# EAGLE design domino-clock-r1-displayonly (EAGLE 5.11)
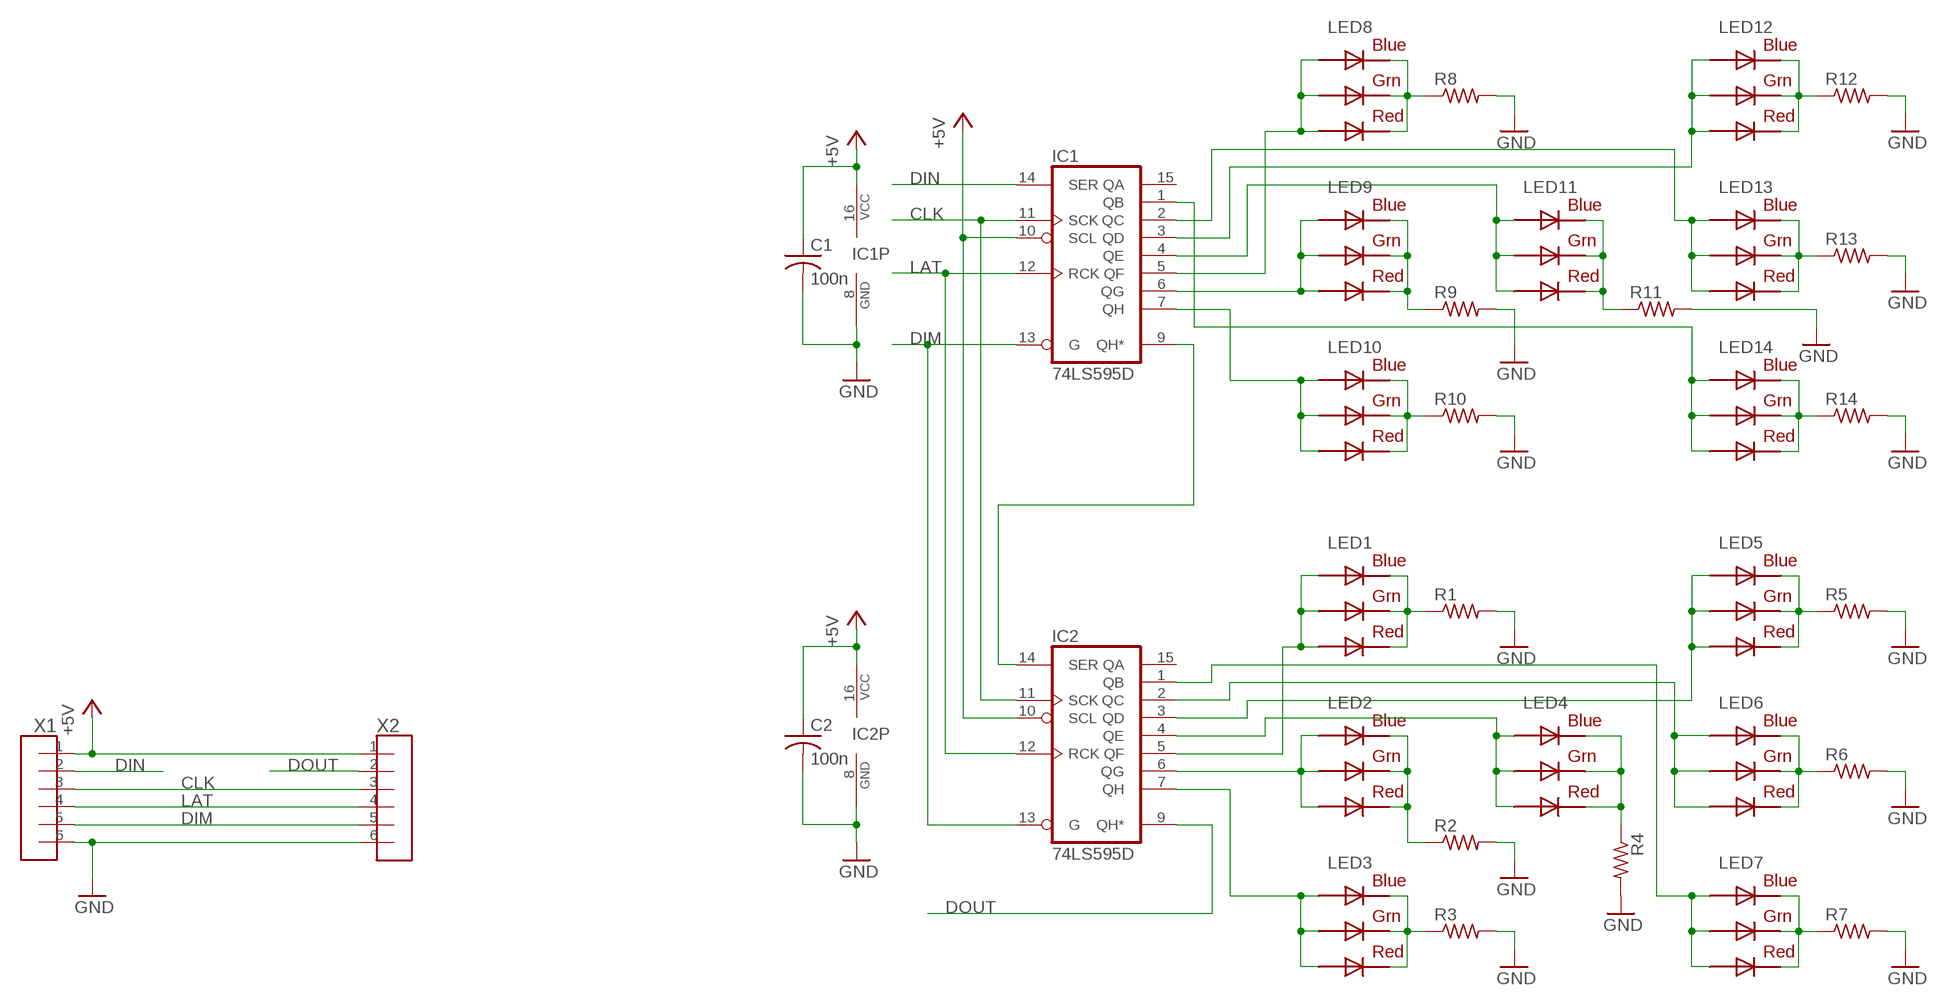
[diagram p0: schematic, sheet 1]

## Parts
C1  100n  C-USC0603  [C0603]
C2  100n  C-USC0603  [C0603]
IC1  74LS595D  [SO16]
IC2  74LS595D  [SO16]
LED1  RGBLED5050  [RGBLED5050]
LED2  RGBLED5050  [RGBLED5050]
LED3  RGBLED5050  [RGBLED5050]
LED4  RGBLED5050  [RGBLED5050]
LED5  RGBLED5050  [RGBLED5050]
LED6  RGBLED5050  [RGBLED5050]
LED7  RGBLED5050  [RGBLED5050]
LED8  RGBLED5050  [RGBLED5050]
LED9  RGBLED5050  [RGBLED5050]
LED10  RGBLED5050  [RGBLED5050]
LED11  RGBLED5050  [RGBLED5050]
LED12  RGBLED5050  [RGBLED5050]
LED13  RGBLED5050  [RGBLED5050]
LED14  RGBLED5050  [RGBLED5050]
R1  R-US_R0805  [R0805]
R2  R-US_R0805  [R0805]
R3  R-US_R0805  [R0805]
R4  R-US_R0805  [R0805]
R5  R-US_R0805  [R0805]
R6  R-US_R0805  [R0805]
R7  R-US_R0805  [R0805]
R8  R-US_R0805  [R0805]
R9  R-US_R0805  [R0805]
R10  R-US_R0805  [R0805]
R11  R-US_R0805  [R0805]
R12  R-US_R0805  [R0805]
R13  R-US_R0805  [R0805]
R14  R-US_R0805  [R0805]
X1  M06-100MIL  [100MIL-6]
X2  M06-100MIL  [100MIL-6]

## Nets
+5V: C1.1 C2.1 IC1.10(SCL) IC1.16(VCC) IC2.10(SCL) IC2.16(VCC) X1.1 X2.1
CLK: IC1.11(SCK) IC2.11(SCK) X1.3 X2.3
DIM: IC1.13(G) IC2.13(G) X1.5 X2.5
DIN: IC1.14(SER) X1.2
DOUT: IC2.9(QH*) X2.2
GND: C1.2 C2.2 IC1.8(GND) IC2.8(GND) R1.2 R2.2 R3.2 R4.2 R5.2 R6.2 R7.2 R8.2 R9.2 R10.2 R11.2 R12.2 R13.2 R14.2 X1.6 X2.6
LAT: IC1.12(RCK) IC2.12(RCK) X1.4 X2.4
N$1: IC1.7(QH) LED10.1(GREEN_A) LED10.2(RED_A) LED10.3(BLUE_A)
N$2: IC1.6(QG) LED9.1(GREEN_A) LED9.2(RED_A) LED9.3(BLUE_A)
N$3: IC1.5(QF) LED8.1(GREEN_A) LED8.2(RED_A) LED8.3(BLUE_A)
N$4: IC1.4(QE) LED11.1(GREEN_A) LED11.2(RED_A) LED11.3(BLUE_A)
N$5: IC1.3(QD) LED12.1(GREEN_A) LED12.2(RED_A) LED12.3(BLUE_A)
N$6: IC1.2(QC) LED13.1(GREEN_A) LED13.2(RED_A) LED13.3(BLUE_A)
N$7: IC1.1(QB) LED14.1(GREEN_A) LED14.2(RED_A) LED14.3(BLUE_A)
N$8: IC1.9(QH*) IC2.14(SER)
N$9: LED1.4(BLUE_C) LED1.5(RED_C) LED1.6(GREEN_C) R1.1
N$10: LED2.4(BLUE_C) LED2.5(RED_C) LED2.6(GREEN_C) R2.1
N$11: LED4.4(BLUE_C) LED4.5(RED_C) LED4.6(GREEN_C) R4.1
N$12: LED3.4(BLUE_C) LED3.5(RED_C) LED3.6(GREEN_C) R3.1
N$13: IC2.7(QH) LED3.1(GREEN_A) LED3.2(RED_A) LED3.3(BLUE_A)
N$14: IC2.6(QG) LED2.1(GREEN_A) LED2.2(RED_A) LED2.3(BLUE_A)
N$15: IC2.5(QF) LED1.1(GREEN_A) LED1.2(RED_A) LED1.3(BLUE_A)
N$16: LED5.4(BLUE_C) LED5.5(RED_C) LED5.6(GREEN_C) R5.1
N$17: IC2.4(QE) LED4.1(GREEN_A) LED4.2(RED_A) LED4.3(BLUE_A)
N$18: LED6.4(BLUE_C) LED6.5(RED_C) LED6.6(GREEN_C) R6.1
N$19: IC2.3(QD) LED5.1(GREEN_A) LED5.2(RED_A) LED5.3(BLUE_A)
N$20: IC2.2(QC) LED6.1(GREEN_A) LED6.2(RED_A) LED6.3(BLUE_A)
N$21: IC2.1(QB) LED7.1(GREEN_A) LED7.2(RED_A) LED7.3(BLUE_A)
N$22: LED7.4(BLUE_C) LED7.5(RED_C) LED7.6(GREEN_C) R7.1
N$23: LED8.4(BLUE_C) LED8.5(RED_C) LED8.6(GREEN_C) R8.1
N$24: LED9.4(BLUE_C) LED9.5(RED_C) LED9.6(GREEN_C) R9.1
N$25: LED10.4(BLUE_C) LED10.5(RED_C) LED10.6(GREEN_C) R10.1
N$26: LED11.4(BLUE_C) LED11.5(RED_C) LED11.6(GREEN_C) R11.1
N$27: LED12.4(BLUE_C) LED12.5(RED_C) LED12.6(GREEN_C) R12.1
N$28: LED13.4(BLUE_C) LED13.5(RED_C) LED13.6(GREEN_C) R13.1
N$29: LED14.4(BLUE_C) LED14.5(RED_C) LED14.6(GREEN_C) R14.1
Unconnected: IC1.15(QA) IC2.15(QA)

## Library data of the parts
C1 C2 = rcl:C-US: CAPACITOR, American symbol
IC1 IC2 = 74xx-us:74*595: 8-bit SHIFT REGISTER, output latch
LED1-LED14 = adafruit:RGBLED: For 5050 RGB LEDs, the order of the LEDs may vary from one manufacturer to another!
R1-R14 = rcl:R-US_: RESISTOR, American symbol
X1 X2 = rbg-generic-headers:M06-100MIL

## Board
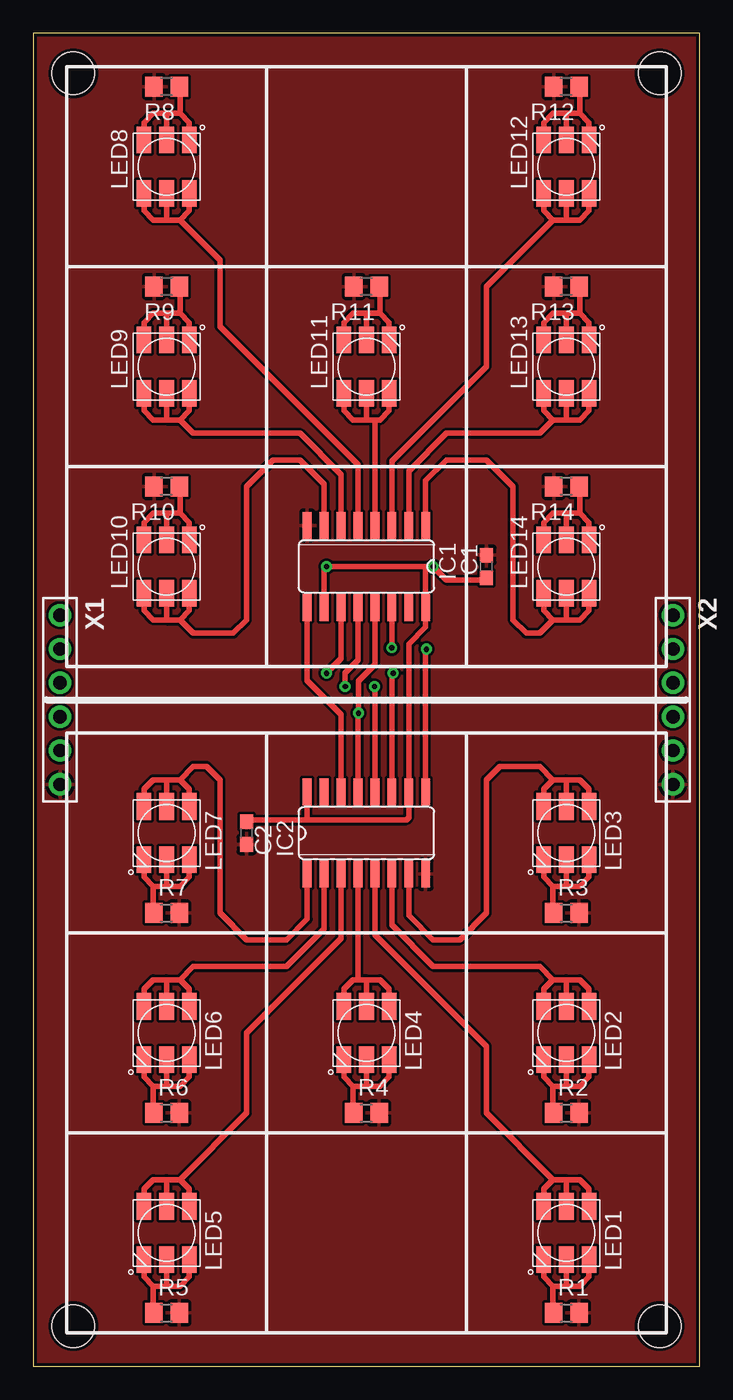
[diagram p1: board, top side]
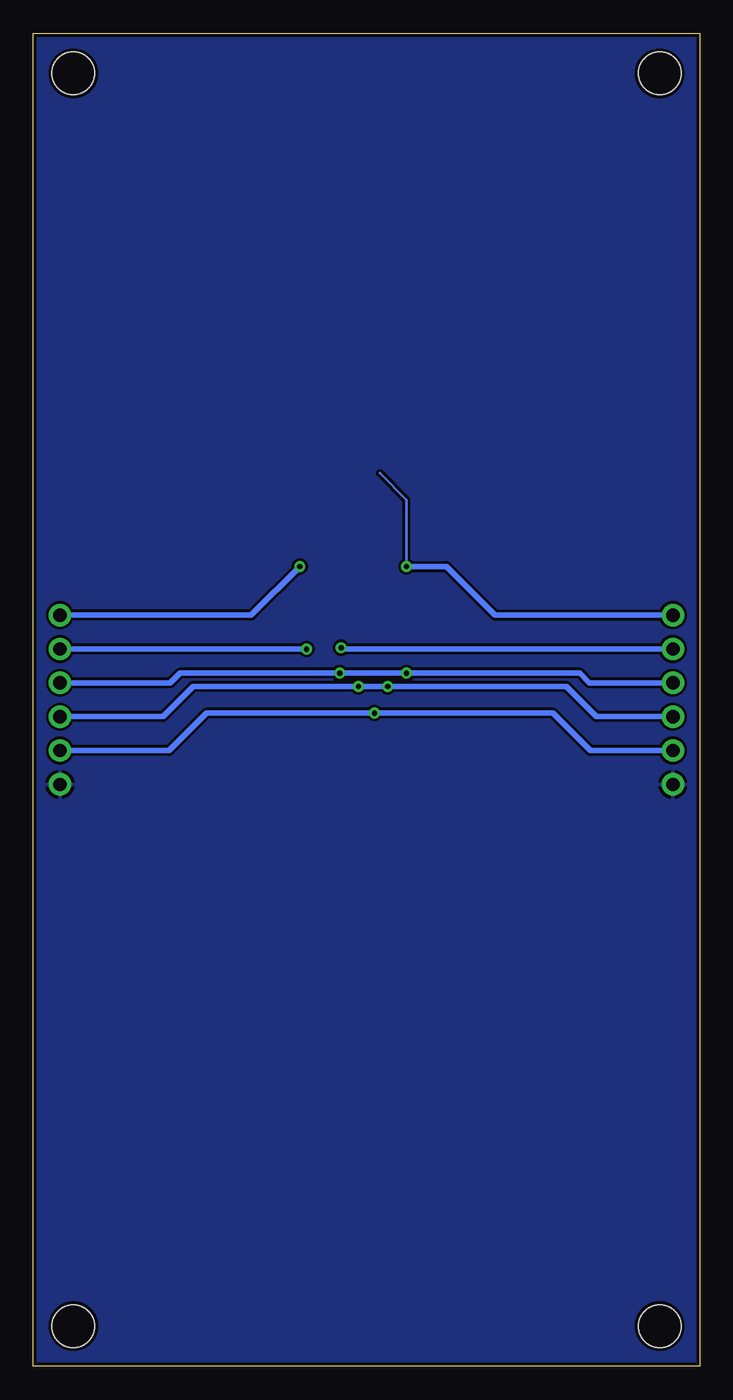
[diagram p2: board, bottom side, seen from below]

Size 50 x 100 mm. Coordinates in mm from the lower left corner, seen from the top.
Outline: 0,0 50,0 50,100 0,100 0,0
Copper layers (1*16): Top 0.035mm / dielectric 1.5mm / Bottom 0.035mm
Design rules "default *": minimum track width 8mil, minimum drill 12mil, track to track 8mil, track to pad 8mil, pad to pad 8mil, via to via 8mil, smd to smd 8mil, copper to edge 10mil, drill to drill 8mil, minimum pad ring 10mil, minimum via ring 8mil, stop-mask expansion 4mil, vias tented up to drill 18mil, thermal gap 10mil
Holes 3.2 mm at 3,97 47,97 47,3 3,3

### Footprints (pad centres in the part's own frame; a part is rotated, then mirrored left to right if it is on the bottom)
C0603 = smd 1.1 x 1: 1 -0.85,0; 2 0.85,0
SO16 = smd 0.66 x 2.032: 1 -4.445,-3.073; 2 -3.175,-3.073; 3 -1.905,-3.073; 4 -0.635,-3.073; 5 0.635,-3.073; 6 1.905,-3.073; 7 3.175,-3.073; 8 4.445,-3.073; 9 4.445,3.073; 10 3.175,3.073; 11 1.905,3.073; 12 0.635,3.073; 13 -0.635,3.073; 14 -1.905,3.073; 15 -3.175,3.073; 16 -4.445,3.073
RGBLED5050 = smd 2 x 1.1: 1 -2,1.7; 2 -2,0; 3 -2,-1.7; 4 2,-1.7; 5 2,0; 6 2,1.7
R0805 = smd 1.3 x 1.5: 1 -0.95,0; 2 0.95,0
100MIL-6 = drill 1 pad 1.676 round: 1 -6.35,0; 2 -3.81,0; 3 -1.27,0; 4 1.27,0; 5 3.81,0; 6 6.35,0

### Placement (x,y rotation side)
C1  34,60 90 top
C2  16,40 270 top
IC1  25,60 180 top
IC2  25,40 0 top
LED1  40,10 270 top
LED2  40,25 270 top
LED3  40,40 270 top
LED4  25,25 270 top
LED5  10,10 270 top
LED6  10,25 270 top
LED7  10,40 270 top
LED8  10,90 90 top
LED9  10,75 90 top
LED10  10,60 90 top
LED11  25,75 90 top
LED12  40,90 90 top
LED13  40,75 90 top
LED14  40,60 90 top
R1  40,4 0 top
R2  40,19 0 top
R3  40,34 0 top
R4  25,19 0 top
R5  10,4 0 top
R6  10,19 0 top
R7  10,34 0 top
R8  10,96 180 top
R9  10,81 180 top
R10  10,66 180 top
R11  25,81 180 top
R12  40,96 180 top
R13  40,81 180 top
R14  40,66 180 top
X1  2,50 270 top
X2  48,50 270 top

### Tracks (layer width: path | path; a pad name or v marks a point on that pad's centre or on a via)
+5V  (via drill 0.4)
  Top 0.406: 20.5,41 16.05,41 C2.1 | 20.5,41 28,41 28.18,41.17 IC2.10 28.18,54.17 29.45,55.45 IC1.16 29.45,59.95 29.5,60 | IC2.16 20.55,41.05 20.5,41 | 33.95,59 C1.1 33.85,59 31,59 v30,60 29.5,60 | IC1.10 21.82,59.83 v22,60 29.5,60
  Bottom 0.203: 24,67 22,65 v22,60
  Bottom 0.406: X1.1 15.35,56.35 19,60 v22,60 | X2.1 33.65,56.35 v30,60
CLK  (via drill 0.4)
  Top 0.406: IC1.11 23.09,53.09 v22,52 | IC2.11 26.91,51.91 v27,52
  Bottom 0.406: X1.3 8.27,51.27 9,52 v22,52 v27,52 39,52 39.73,51.27 X2.3
DIM  (via drill 0.4)
  Top 0.406: IC2.13 24.36,48.97 v24.4,49 24.4,51.4 25.64,52.63 IC1.13
  Bottom 0.406: X1.5 8.19,46.19 11,49 v24.4,49 37,49 39.81,46.19 X2.5
DIN  (via drill 0.4)
  Top 0.406: v26.9,53.9 IC1.14
  Bottom 0.406: X1.2 26.81,53.81 v26.9,53.9
DOUT  (via drill 0.4)
  Top 0.406: IC2.9 29.45,53.74 v29.5,53.8
  Bottom 0.406: v29.5,53.8 X2.2
GND
  pour Top: -1,-1 51,-1 51,101 -1,101
  pour Bottom: -1,-1 51,-1 51,101 -1,101
LAT  (via drill 0.4)
  Top 0.406: IC2.12 25.64,50.97 v25.6,51 | IC1.12 24.36,52.97 23.4,52 v23.4,51
  Bottom 0.406: X1.4 7.73,48.73 10,51 v23.4,51 v25.6,51 38,51 40.27,48.73 X2.4
N$1
  Top 0.406: LED10.1 8.3,56.7 9,56 10,56 | LED10.2 10,56 | LED10.3 11.7,56.7 11,56 | 10,56 11,56 | IC1.7 21.82,66.17 20,68 18,68 16,66 16,56 15,55 12,55 11,56
N$2
  Top 0.406: LED9.1 8.3,71.7 9,71 10,71 | 10,71 LED9.2 | LED9.3 11.7,71.7 11,71 | 10,71 11,71 | IC1.6 23.09,66.91 20,70 12,70 11,71
N$3
  Top 0.406: LED8.1 8.3,86.7 9,86 10,86 | 10,86 LED8.2 | LED8.3 11.7,86.7 11,86 | 11,86 10,86 | IC1.5 24.36,67.64 14,78 14,83 11,86
N$4
  Top 0.406: LED11.1 23.3,71.7 24,71 25,71 | 25,71 LED11.2 | LED11.3 26.7,71.7 26,71 25.6,71 | 25.6,71 25,71 | IC1.4 25.64,70.97 25.6,71
N$5
  Top 0.406: LED12.1 38.3,86.7 39,86 | 39,86 40,86 | 40,86 LED12.2 | LED12.3 41.7,86.7 41,86 40,86 | IC1.3 26.91,67.91 34,75 34,81 39,86
N$6
  Top 0.406: LED13.1 38.3,71.7 39,71 | 39,71 40,71 | 40,71 LED13.2 | LED13.3 41.7,71.7 41,71 40,71 | IC1.2 28.18,67.17 31,70 38,70 39,71
N$7
  Top 0.406: LED14.1 38.3,56.7 39,56 | 39,56 40,56 | 40,56 LED14.2 | LED14.3 41.7,56.7 41,56 40,56 | IC1.1 29.45,66.44 31,68 34,68 36,66 36,56 37,55 38,55 39,56
N$8
  Top 0.406: IC2.14 23.09,48.91 20.55,51.45 IC1.9
N$9
  Top 0.406: LED1.4 38.3,6.7 39,6 | 39,6 39,4.05 R1.1 | 40,6 LED1.5 | 39,6 40,6 | LED1.6 41.7,6.7 41,6 40,6
N$10
  Top 0.406: LED2.4 38.3,21.7 39,21 | 39,21 39,19.05 R2.1 | 40,21 LED2.5 | 39,21 40,21 | LED2.6 41.7,21.7 41,21 40,21
N$11
  Top 0.406: LED4.4 23.3,21.7 24,21 | 24,21 24,19.05 R4.1 | 25,21 LED4.5 | 24,21 25,21 | LED4.6 26.7,21.7 26,21 25,21
N$12
  Top 0.406: LED3.4 38.3,36.7 39,36 | 39,36 39,34.05 R3.1 | 40,36 LED3.5 | 39,36 40,36 | LED3.6 41.7,36.7 41,36 40,36
N$13
  Top 0.406: LED3.1 41.7,43.3 41,44 40,44 | 40,44 LED3.2 | LED3.3 38.3,43.3 39,44 | 39,44 40,44 | IC2.7 28.18,33.83 30,32 32,32 34,34 34,44 35,45 38,45 39,44
N$14
  Top 0.406: LED2.3 38.3,28.3 39,29 | 39,29 40,29 | 40,29 LED2.2 | LED2.1 41.7,28.3 41,29 40,29 | IC2.6 26.91,33.09 30,30 38,30 39,29
N$15
  Top 0.406: LED1.3 38.3,13.3 39,14 | 40,14 39,14 | LED1.2 40,14 | LED1.1 41.7,13.3 41,14 40,14 | IC2.5 25.64,32.37 34,24 34,19 39,14
N$16
  Top 0.406: LED5.4 8.3,6.7 9,6 | 9,6 9,4.05 R5.1 | 10,6 LED5.5 | 9,6 10,6 | LED5.6 11.7,6.7 11,6 10,6
N$17
  Top 0.406: LED4.1 26.7,28.3 26,29 25,29 | 25,29 LED4.2 | LED4.3 23.3,28.3 24,29 24.4,29 | 24.4,29 25,29 | IC2.4 24.36,29.04 24.4,29
N$18
  Top 0.406: LED6.4 8.3,21.7 9,21 | 9,21 9,19.05 R6.1 | 10,21 LED6.5 | 9,21 10,21 | LED6.6 11.7,21.7 11,21 10,21
N$19
  Top 0.406: LED5.3 8.3,13.3 9,14 10,14 | 10,14 LED5.2 | LED5.1 11.7,13.3 11,14 | 10,14 11,14 | IC2.3 23.09,32.09 16,25 16,19 11,14
N$20
  Top 0.406: LED6.1 11.7,28.3 11,29 | 10,29 11,29 | 10,29 LED6.2 | LED6.3 8.3,28.3 9,29 10,29 | IC2.2 21.82,32.83 19,30 12,30 11,29
N$21
  Top 0.406: LED7.3 8.3,43.3 9,44 10,44 | 10,44 LED7.2 | LED7.1 11.7,43.3 11,44 | 11,44 10,44 | IC2.1 20.55,33.55 19,32 16,32 14,34 14,44 13,45 12,45 11,44
N$22
  Top 0.406: LED7.4 8.3,36.7 9,36 | 9,36 9,34.05 R7.1 | 10,36 LED7.5 | 9,36 10,36 | LED7.6 11.7,36.7 11,36 10,36
N$23
  Top 0.406: LED8.6 8.3,93.3 9,94 10,94 | 10,94 LED8.5 | LED8.4 11.7,93.3 11,94 | 11,94 11,95.95 R8.1 | 10,94 11,94
N$24
  Top 0.406: LED9.4 11.7,78.3 11,79 | 11,79 11,80.95 R9.1 | LED9.6 8.3,78.3 9,79 10,79 | 10,79 11,79 | 10,79 LED9.5
N$25
  Top 0.406: LED10.4 11.7,63.3 11,64 | 11,64 11,65.95 R10.1 | LED10.6 8.3,63.3 9,64 10,64 | 10,64 11,64 | 10,64 LED10.5
N$26
  Top 0.406: LED11.4 26.7,78.3 26,79 | 26,79 26,80.95 R11.1 | LED11.6 23.3,78.3 24,79 25,79 | 25,79 26,79 | 25,79 LED11.5
N$27
  Top 0.406: LED12.4 41.7,93.3 41,94 | 41,94 41,95.95 R12.1 | LED12.6 38.3,93.3 39,94 40,94 | 40,94 41,94 | 40,94 LED12.5
N$28
  Top 0.406: LED13.4 41.7,78.3 41,79 | 41,79 41,80.95 R13.1 | LED13.6 38.3,78.3 39,79 40,79 | 40,79 41,79 | 40,79 LED13.5
N$29
  Top 0.406: LED14.4 41.7,63.3 41,64 | 41,64 41,65.95 R14.1 | LED14.6 38.3,63.3 39,64 40,64 | 40,64 41,64 | 40,64 LED14.5